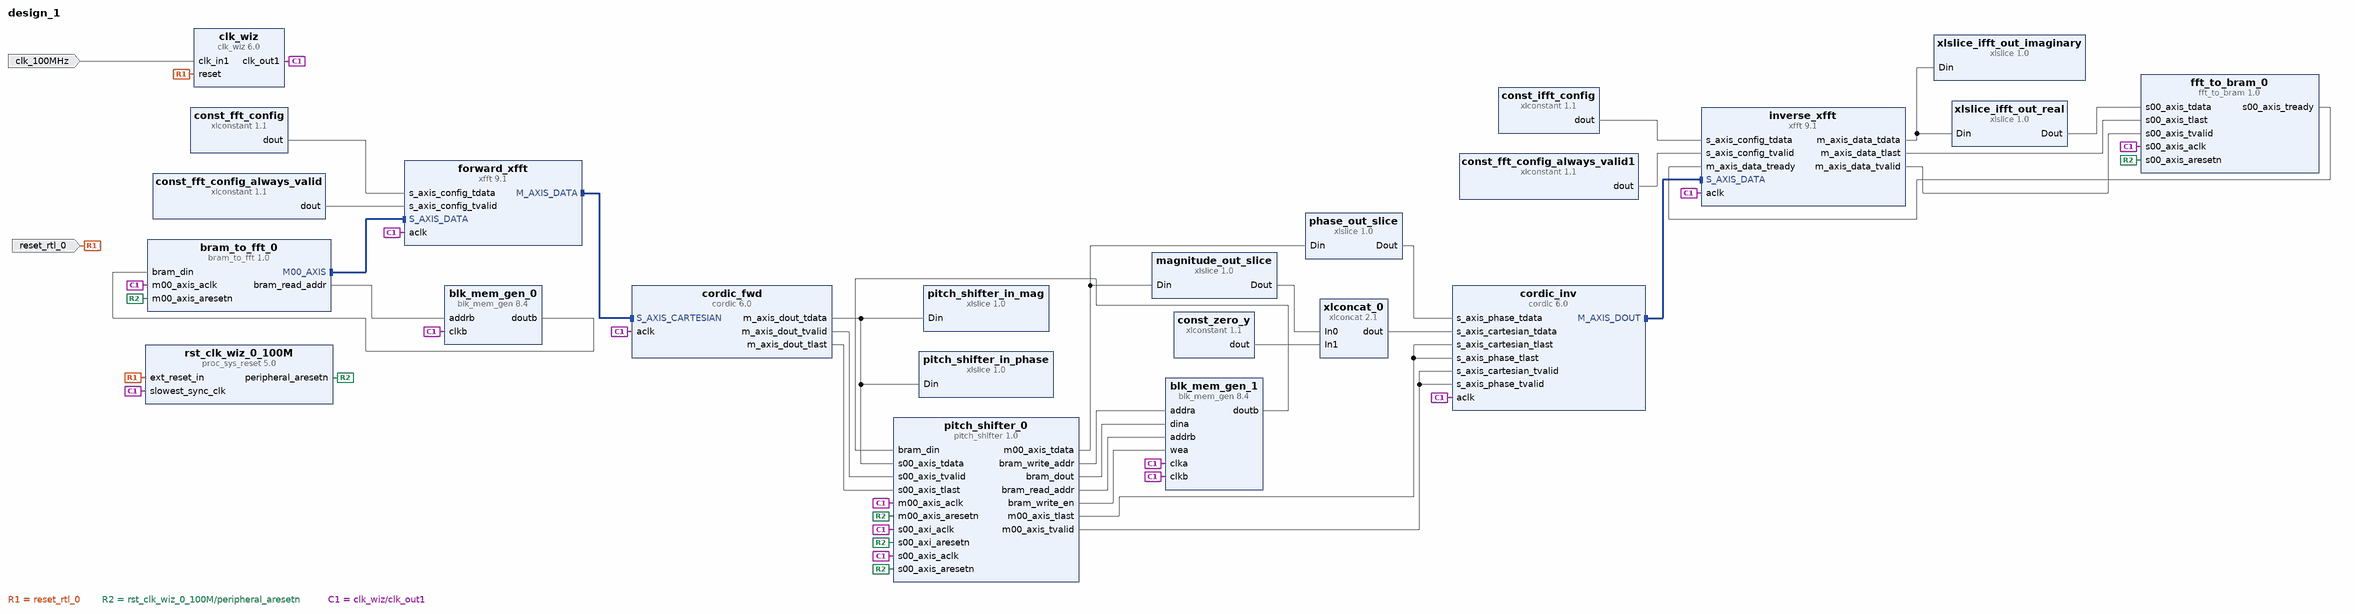
[diagram p0: block diagram of the top level]
# Vivado block design design_1, xc7a100tcsg324-1, Vivado 2018.2
create_bd_design design_1

create_bd_port -dir I -type rst reset_rtl_0
set_property -dict {CONFIG.POLARITY ACTIVE_HIGH} [get_bd_ports reset_rtl_0]
create_bd_port -dir I -type clk clk_100MHz
set_property -dict {CONFIG.FREQ_HZ 100000000} [get_bd_ports clk_100MHz]

create_bd_cell -type ip -vlnv xilinx.com:ip:xfft:9.1 forward_xfft
set_property -dict [list \
  CONFIG.transform_length 4096 \
  CONFIG.target_clock_frequency 100 \
  CONFIG.implementation_options automatically_select \
  CONFIG.target_data_throughput 1 \
  CONFIG.phase_factor_width 9 \
  CONFIG.scaling_options scaled \
  CONFIG.xk_index true \
  CONFIG.output_ordering natural_order \
  CONFIG.number_of_stages_using_block_ram_for_data_and_phase_factors 0 \
] [get_bd_cells forward_xfft]
create_bd_cell -type ip -vlnv xilinx.com:ip:blk_mem_gen:8.4 blk_mem_gen_0
set_property -dict [list \
  CONFIG.Memory_Type Simple_Dual_Port_RAM \
  CONFIG.Enable_32bit_Address false \
  CONFIG.Use_Byte_Write_Enable false \
  CONFIG.Assume_Synchronous_Clk false \
  CONFIG.Write_Width_A 16 \
  CONFIG.Write_Depth_A 4096 \
  CONFIG.Operating_Mode_A READ_FIRST \
  CONFIG.Enable_A Always_Enabled \
  CONFIG.Write_Width_B 16 \
  CONFIG.Read_Width_B 16 \
  CONFIG.Enable_B Always_Enabled \
  CONFIG.Register_PortB_Output_of_Memory_Primitives true \
  CONFIG.Load_Init_File true \
  CONFIG.Coe_File ../../../../../../bram_sine_init.coe \
  CONFIG.Use_RSTB_Pin false \
  CONFIG.Port_A_Write_Rate 50 \
  CONFIG.Port_B_Clock 100 \
  CONFIG.Port_B_Enable_Rate 100 \
  CONFIG.use_bram_block Stand_Alone \
] [get_bd_cells blk_mem_gen_0]
create_bd_cell -type ip -vlnv xilinx.com:ip:proc_sys_reset:5.0 rst_clk_wiz_0_100M
create_bd_cell -type ip -vlnv xilinx.com:ip:xfft:9.1 inverse_xfft
set_property -dict [list \
  CONFIG.transform_length 4096 \
  CONFIG.target_clock_frequency 100 \
  CONFIG.implementation_options automatically_select \
  CONFIG.target_data_throughput 1 \
  CONFIG.input_width 16 \
  CONFIG.phase_factor_width 9 \
  CONFIG.scaling_options scaled \
  CONFIG.output_ordering natural_order \
  CONFIG.number_of_stages_using_block_ram_for_data_and_phase_factors 0 \
] [get_bd_cells inverse_xfft]
create_bd_cell -type ip -vlnv xilinx.com:ip:xlconstant:1.1 const_fft_config_always_valid
create_bd_cell -type ip -vlnv xilinx.com:ip:xlconstant:1.1 const_fft_config
set_property -dict {CONFIG.CONST_WIDTH 32 CONFIG.CONST_VAL 11184811} [get_bd_cells const_fft_config]
create_bd_cell -type ip -vlnv xilinx.com:ip:xlconstant:1.1 const_ifft_config
set_property -dict {CONFIG.CONST_WIDTH 32 CONFIG.CONST_VAL 0} [get_bd_cells const_ifft_config]
create_bd_cell -type ip -vlnv xilinx.com:ip:cordic:6.0 cordic_fwd
set_property -dict [list \
  CONFIG.Functional_Selection Translate \
  CONFIG.Data_Format SignedFraction \
  CONFIG.Input_Width 16 \
  CONFIG.Output_Width 16 \
  CONFIG.Coarse_Rotation true \
  CONFIG.Compensation_Scaling No_Scale_Compensation \
  CONFIG.cartesian_has_tlast true \
  CONFIG.flow_control NonBlocking \
  CONFIG.out_tlast_behv Pass_Cartesian_TLAST \
] [get_bd_cells cordic_fwd]
create_bd_cell -type ip -vlnv xilinx.com:ip:blk_mem_gen:8.4 blk_mem_gen_1
set_property -dict [list \
  CONFIG.Memory_Type Simple_Dual_Port_RAM \
  CONFIG.Enable_32bit_Address false \
  CONFIG.Use_Byte_Write_Enable false \
  CONFIG.Assume_Synchronous_Clk false \
  CONFIG.Write_Width_A 32 \
  CONFIG.Write_Depth_A 4096 \
  CONFIG.Operating_Mode_A READ_FIRST \
  CONFIG.Enable_A Always_Enabled \
  CONFIG.Write_Width_B 32 \
  CONFIG.Read_Width_B 32 \
  CONFIG.Enable_B Always_Enabled \
  CONFIG.Register_PortB_Output_of_Memory_Primitives true \
  CONFIG.Fill_Remaining_Memory_Locations true \
  CONFIG.Use_RSTB_Pin false \
  CONFIG.Port_A_Write_Rate 50 \
  CONFIG.Port_B_Clock 100 \
  CONFIG.Port_B_Enable_Rate 100 \
  CONFIG.use_bram_block Stand_Alone \
] [get_bd_cells blk_mem_gen_1]
create_bd_cell -type ip -vlnv user.org:user:bram_to_fft:1.0 bram_to_fft_0
create_bd_cell -type ip -vlnv xilinx.com:ip:clk_wiz:6.0 clk_wiz
create_bd_cell -type ip -vlnv xilinx.com:ip:cordic:6.0 cordic_inv
set_property -dict [list \
  CONFIG.Functional_Selection Rotate \
  CONFIG.Data_Format SignedFraction \
  CONFIG.Input_Width 16 \
  CONFIG.Output_Width 16 \
  CONFIG.Coarse_Rotation true \
  CONFIG.Compensation_Scaling No_Scale_Compensation \
  CONFIG.cartesian_has_tlast true \
  CONFIG.phase_has_tlast true \
  CONFIG.flow_control NonBlocking \
  CONFIG.out_tlast_behv Pass_Cartesian_TLAST \
] [get_bd_cells cordic_inv]
create_bd_cell -type ip -vlnv xilinx.com:ip:xlslice:1.0 magnitude_out_slice
set_property -dict [list \
  CONFIG.DIN_TO 0 \
  CONFIG.DIN_FROM 15 \
  CONFIG.DIN_WIDTH 32 \
  CONFIG.DOUT_WIDTH 16 \
] [get_bd_cells magnitude_out_slice]
create_bd_cell -type ip -vlnv xilinx.com:ip:xlslice:1.0 phase_out_slice
set_property -dict {CONFIG.DIN_TO 16 CONFIG.DIN_FROM 31 CONFIG.DIN_WIDTH 32 CONFIG.DOUT_WIDTH 16} [get_bd_cells phase_out_slice]
create_bd_cell -type ip -vlnv xilinx.com:ip:xlconcat:2.1 xlconcat_0
create_bd_cell -type ip -vlnv xilinx.com:ip:xlconstant:1.1 const_zero_y
set_property -dict {CONFIG.CONST_WIDTH 16 CONFIG.CONST_VAL 0} [get_bd_cells const_zero_y]
create_bd_cell -type ip -vlnv xilinx.com:ip:xlconstant:1.1 const_fft_config_always_valid1
create_bd_cell -type ip -vlnv xilinx.com:ip:xlslice:1.0 xlslice_ifft_out_real
set_property -dict {CONFIG.DIN_FROM 15 CONFIG.DOUT_WIDTH 16} [get_bd_cells xlslice_ifft_out_real]
create_bd_cell -type ip -vlnv user.org:user:fft_to_bram:1.0 fft_to_bram_0
set_property -dict {CONFIG.C_S00_AXIS_TDATA_WIDTH 16} [get_bd_cells fft_to_bram_0]
create_bd_cell -type ip -vlnv xilinx.com:ip:xlslice:1.0 xlslice_ifft_out_imaginary
set_property -dict {CONFIG.DIN_FROM 15 CONFIG.DOUT_WIDTH 16} [get_bd_cells xlslice_ifft_out_imaginary]
create_bd_cell -type ip -vlnv xilinx.com:ip:xlslice:1.0 pitch_shifter_in_mag
set_property -dict {CONFIG.DIN_FROM 15 CONFIG.DOUT_WIDTH 16} [get_bd_cells pitch_shifter_in_mag]
create_bd_cell -type ip -vlnv user.org:user:pitch_shifter:1.0 pitch_shifter_0
set_property -dict {CONFIG.C_M00_AXIS_TDATA_WIDTH 32 CONFIG.C_S00_AXIS_TDATA_WIDTH 32} [get_bd_cells pitch_shifter_0]
create_bd_cell -type ip -vlnv xilinx.com:ip:xlslice:1.0 pitch_shifter_in_phase
set_property -dict {CONFIG.DIN_TO 16 CONFIG.DIN_FROM 31 CONFIG.DOUT_WIDTH 16} [get_bd_cells pitch_shifter_in_phase]

# ---- connections ----

connect_bd_intf_net [get_bd_intf_pins bram_to_fft_0/M00_AXIS] [get_bd_intf_pins forward_xfft/S_AXIS_DATA]
connect_bd_intf_net [get_bd_intf_pins forward_xfft/M_AXIS_DATA] [get_bd_intf_pins cordic_fwd/S_AXIS_CARTESIAN]
connect_bd_intf_net [get_bd_intf_pins cordic_inv/M_AXIS_DOUT] [get_bd_intf_pins inverse_xfft/S_AXIS_DATA]
connect_bd_net -net reset_rtl_0_1 [get_bd_ports reset_rtl_0] [get_bd_pins rst_clk_wiz_0_100M/ext_reset_in] [get_bd_pins clk_wiz/reset]
connect_bd_net [get_bd_pins rst_clk_wiz_0_100M/peripheral_aresetn] \
  [get_bd_pins bram_to_fft_0/m00_axis_aresetn] [get_bd_pins fft_to_bram_0/s00_axis_aresetn] \
  [get_bd_pins pitch_shifter_0/m00_axis_aresetn] [get_bd_pins pitch_shifter_0/s00_axis_aresetn] \
  [get_bd_pins pitch_shifter_0/s00_axi_aresetn]
connect_bd_net [get_bd_pins bram_to_fft_0/bram_read_addr] [get_bd_pins blk_mem_gen_0/addrb]
connect_bd_net [get_bd_pins blk_mem_gen_0/doutb] [get_bd_pins bram_to_fft_0/bram_din]
connect_bd_net -net xlconstant_1_dout [get_bd_pins const_fft_config/dout] [get_bd_pins forward_xfft/s_axis_config_tdata]
connect_bd_net -net xlconstant_2_dout [get_bd_pins const_ifft_config/dout] [get_bd_pins inverse_xfft/s_axis_config_tdata]
connect_bd_net [get_bd_pins pitch_shifter_0/bram_write_addr] [get_bd_pins blk_mem_gen_1/addra]
connect_bd_net [get_bd_pins pitch_shifter_0/bram_dout] [get_bd_pins blk_mem_gen_1/dina]
connect_bd_net [get_bd_pins pitch_shifter_0/bram_read_addr] [get_bd_pins blk_mem_gen_1/addrb]
connect_bd_net [get_bd_pins pitch_shifter_0/bram_write_en] [get_bd_pins blk_mem_gen_1/wea]
connect_bd_net [get_bd_pins blk_mem_gen_1/doutb] [get_bd_pins pitch_shifter_0/bram_din]
connect_bd_net -net clk_wiz_0_clk_out1 [get_bd_pins clk_wiz/clk_out1] \
  [get_bd_pins bram_to_fft_0/m00_axis_aclk] [get_bd_pins forward_xfft/aclk] [get_bd_pins cordic_fwd/aclk] \
  [get_bd_pins inverse_xfft/aclk] [get_bd_pins blk_mem_gen_0/clkb] [get_bd_pins blk_mem_gen_1/clkb] \
  [get_bd_pins blk_mem_gen_1/clka] [get_bd_pins rst_clk_wiz_0_100M/slowest_sync_clk] [get_bd_pins cordic_inv/aclk] \
  [get_bd_pins fft_to_bram_0/s00_axis_aclk] [get_bd_pins pitch_shifter_0/m00_axis_aclk] \
  [get_bd_pins pitch_shifter_0/s00_axis_aclk] [get_bd_pins pitch_shifter_0/s00_axi_aclk]
connect_bd_net [get_bd_ports clk_100MHz] [get_bd_pins clk_wiz/clk_in1]
connect_bd_net [get_bd_pins phase_out_slice/Dout] [get_bd_pins cordic_inv/s_axis_phase_tdata]
connect_bd_net [get_bd_pins magnitude_out_slice/Dout] [get_bd_pins xlconcat_0/In0]
connect_bd_net -net xlconstant_0_dout1 [get_bd_pins const_zero_y/dout] [get_bd_pins xlconcat_0/In1]
connect_bd_net [get_bd_pins xlconcat_0/dout] [get_bd_pins cordic_inv/s_axis_cartesian_tdata]
connect_bd_net [get_bd_pins const_fft_config_always_valid/dout] [get_bd_pins forward_xfft/s_axis_config_tvalid]
connect_bd_net [get_bd_pins const_fft_config_always_valid1/dout] [get_bd_pins inverse_xfft/s_axis_config_tvalid]
connect_bd_net [get_bd_pins inverse_xfft/m_axis_data_tdata] [get_bd_pins xlslice_ifft_out_real/Din] [get_bd_pins xlslice_ifft_out_imaginary/Din]
connect_bd_net -net xlslice_0_Dout [get_bd_pins xlslice_ifft_out_real/Dout] [get_bd_pins fft_to_bram_0/s00_axis_tdata]
connect_bd_net [get_bd_pins inverse_xfft/m_axis_data_tlast] [get_bd_pins fft_to_bram_0/s00_axis_tlast]
connect_bd_net [get_bd_pins fft_to_bram_0/s00_axis_tready] [get_bd_pins inverse_xfft/m_axis_data_tready]
connect_bd_net [get_bd_pins inverse_xfft/m_axis_data_tvalid] [get_bd_pins fft_to_bram_0/s00_axis_tvalid]
connect_bd_net [get_bd_pins cordic_fwd/m_axis_dout_tdata] \
  [get_bd_pins pitch_shifter_in_mag/Din] [get_bd_pins pitch_shifter_0/s00_axis_tdata] \
  [get_bd_pins pitch_shifter_in_phase/Din]
connect_bd_net [get_bd_pins cordic_fwd/m_axis_dout_tvalid] [get_bd_pins pitch_shifter_0/s00_axis_tvalid]
connect_bd_net [get_bd_pins cordic_fwd/m_axis_dout_tlast] [get_bd_pins pitch_shifter_0/s00_axis_tlast]
connect_bd_net [get_bd_pins pitch_shifter_0/m00_axis_tdata] [get_bd_pins phase_out_slice/Din] [get_bd_pins magnitude_out_slice/Din]
connect_bd_net [get_bd_pins pitch_shifter_0/m00_axis_tlast] \
  [get_bd_pins cordic_inv/s_axis_phase_tlast] [get_bd_pins cordic_inv/s_axis_cartesian_tlast]
connect_bd_net [get_bd_pins pitch_shifter_0/m00_axis_tvalid] \
  [get_bd_pins cordic_inv/s_axis_cartesian_tvalid] [get_bd_pins cordic_inv/s_axis_phase_tvalid]

validate_bd_design
save_bd_design
